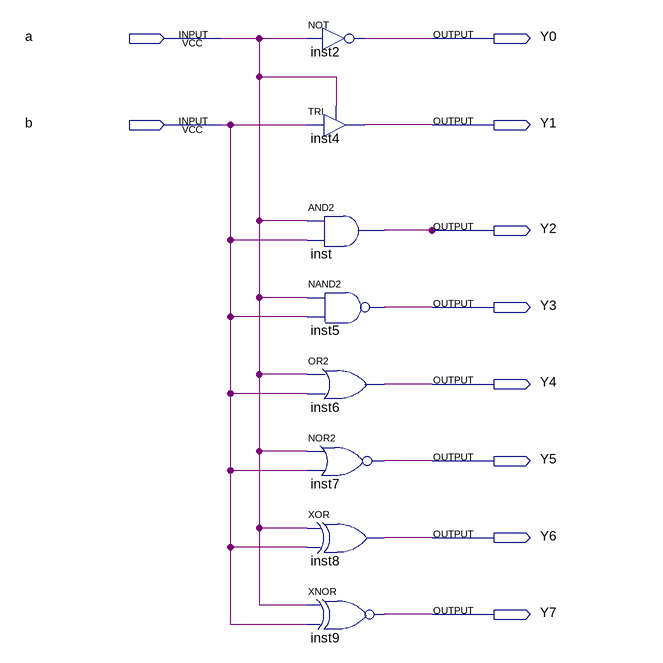
[diagram p0: schematic sheet]
// Quartus schematic 913032.bdf as structural Verilog: 8 symbols, 10 pins
module \913032  (
  input  a,
  input  b,
  output Y0,
  output Y1,
  output Y2,
  output Y3,
  output Y4,
  output Y5,
  output Y6,
  output Y7
);

  not inst2 (Y0, a);
  TRI inst4 (.IN(b), .OE(a), .OUT(Y1));
  and inst (Y2, a, b);
  nand inst5 (Y3, a, b);
  or inst6 (Y4, a, b);
  nor inst7 (Y5, a, b);
  xor inst8 (Y6, a, b);
  xnor inst9 (Y7, a, b);
endmodule
